# Altium schematic sheet Speed Controller.SchDoc
size A4
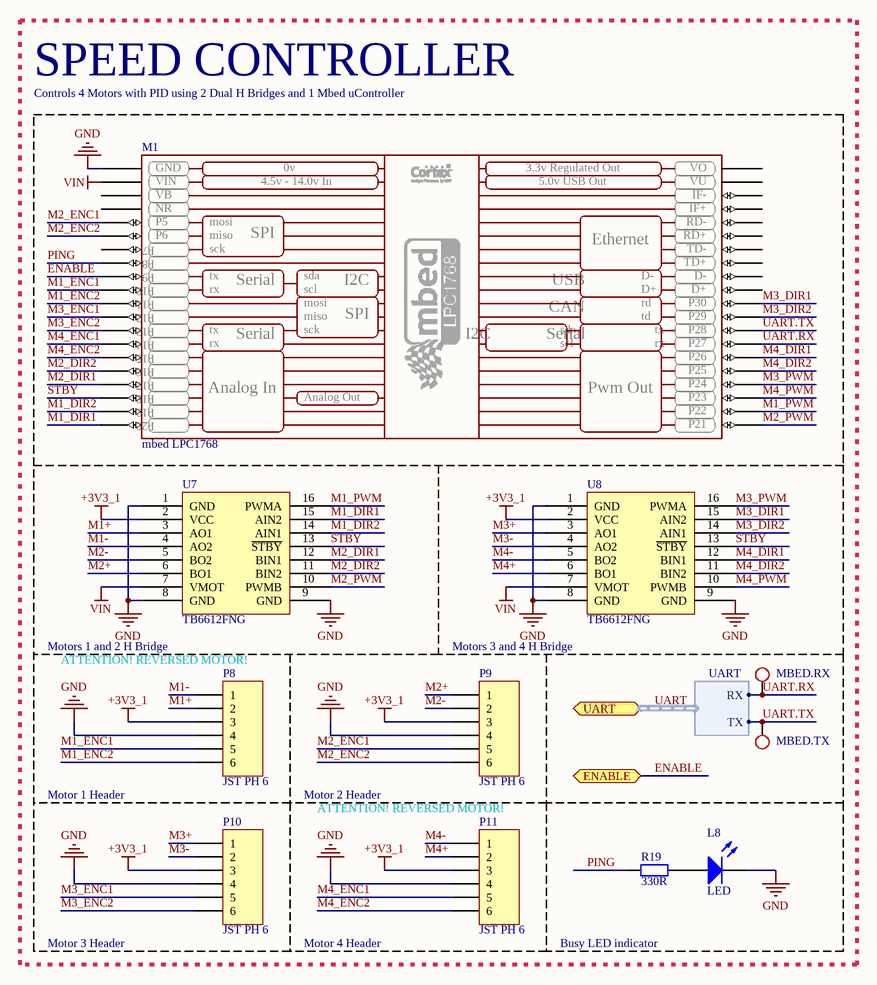
[diagram p0: Speed Controller.SchDoc]

## Parts
L8  LED  [LED0805]
M1  mbed LPC1768  [DIP40-LARGE]
MBED.RX  Test Point  [TP1]  (value not drawn)  (no BOM)
MBED.TX  Test Point  [TP1]  (value not drawn)  (no BOM)
P8  JST PH 6  [B6B-PH-K]
P9  JST PH 6  [B6B-PH-K]
P10  JST PH 6  [B6B-PH-K]
P11  JST PH 6  [B6B-PH-K]
R19  330R  [RES1206]
U7  TB6612FNG  [TB6612FNG]
U8  TB6612FNG  [TB6612FNG]

## Ports
ENABLE, UART (harness UART)

## Harnesses
UART: RX, TX

## Nets
+3V3_1: P8.3 P9.3 P10.3 P11.3 U7.2(VCC) U8.2(VCC)
GND: L8.2(K) M1.1(GND) P8.4 P9.4 P10.4 P11.4 U7.1(GND) U7.8(GND) U7.9(GND) U8.1(GND) U8.8(GND) U8.9(GND)
VIN: M1.2(VIN) U7.7(VMOT) U8.7(VMOT)
ENABLE: M1.9(P9) ; port ENABLE
M1+: P8.2 U7.3(AO1)
M1-: P8.1 U7.4(AO2)
M1_DIR1: M1.20(P20) U7.15(AIN2)
M1_DIR2: M1.19(P19) U7.14(AIN1)
M1_ENC1: M1.10(P10) P8.5
M1_ENC2: M1.11(P11) P8.6
M1_PWM: M1.22(P22) U7.16(PWMA)
M2+: P9.1 U7.6(BO1)
M2-: P9.2 U7.5(BO2)
M2_DIR1: M1.17(P17) U7.12(BIN1)
M2_DIR2: M1.16(P16) U7.11(BIN2)
M2_ENC1: M1.5(P5) P9.5
M2_ENC2: M1.6(P6) P9.6
M2_PWM: M1.21(P21) U7.10(PWMB)
M3+: P10.1 U8.3(AO1)
M3-: P10.2 U8.4(AO2)
M3_DIR1: M1.30(P30) U8.15(AIN2)
M3_DIR2: M1.29(P29) U8.14(AIN1)
M3_ENC1: M1.12(P12) P10.5
M3_ENC2: M1.13(P13) P10.6
M3_PWM: M1.24(P24) U8.16(PWMA)
M4+: P11.2 U8.6(BO1)
M4-: P11.1 U8.5(BO2)
M4_DIR1: M1.26(P26) U8.12(BIN1)
M4_DIR2: M1.25(P25) U8.11(BIN2)
M4_ENC1: M1.14(P14) P11.5
M4_ENC2: M1.15(P15) P11.6
M4_PWM: M1.23(P23) U8.10(PWMB)
PING: M1.8(P8) R19.2
STBY: M1.18(P18) U7.13(~{STBY}) U8.13(~{STBY})
UART.RX: M1.27(P27) MBED.RX.1 ; port UART.RX
UART.TX: M1.28(P28) MBED.TX.1 ; port UART.TX
NetL8_1: L8.1(A) R19.1

Not connected (* = marked no-connect by the designer): M1 3(VB) 4(NR) 7(P7) 31(D+) 32(D-) 33(TD+) 34(TD-) 35(RD+) 36(RD-) 37(IF+) 38(IF-) 39(VU) 40(VO)

## Buses and harness runs
harness UART = port UART

## Notes on the sheet
- SPEED CONTROLLER
- Controls 4 Motors with PID using 2 Dual H Bridges and 1 Mbed uController
- Motors 1 and 2 H Bridge
- (near P8) ATTENTION! REVERSED MOTOR!
- Motors 3 and 4 H Bridge
- Motor 1 Header
- Motor 2 Header
- ATTENTION! REVERSED MOTOR!
- Motor 3 Header
- Motor 4 Header
- Busy LED indicator
- (in symbol mbed LPC1768) 0v; 3.3v Regulated Out; 4.5v - 14.0v In; 5.0v USB Out; mosi; miso; SPI; Ethernet; sck; tx; sda; Serial; I2C; USB; rx; scl; rd; CAN; td; Analog In; Pwm Out; Analog Out

## Library data of the parts
MBED.RX MBED.TX = Test Point: Test Point for Osciloscope measurements
R19 = RES
U7 U8 = TB6612FNG: H BRIDGE